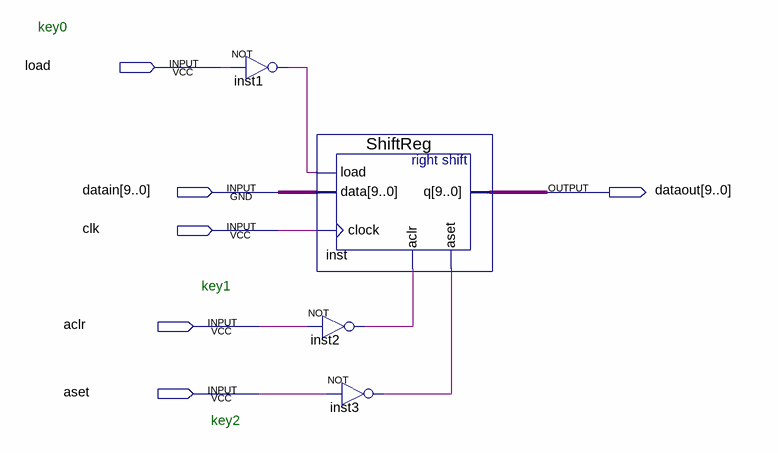
[diagram p0: schematic sheet]
// Quartus schematic cdlab5.bdf as structural Verilog: 4 symbols, 6 pins
module cdlab5 (
  input  load,
  input  [9:0] datain,
  input  clk,
  input  aclr,
  input  aset,
  output [9:0] dataout
);

  wire inst1_out, inst2_out, inst3_out;

  not inst1 (inst1_out, load);
  ShiftReg inst (.load(inst1_out), .data(datain), .clock(clk), .aclr(inst2_out), .aset(inst3_out), .q(dataout));
  not inst2 (inst2_out, aclr);
  not inst3 (inst3_out, aset);

  // Notes on the sheet:
  //   key0
  //   key1
  //   key2
endmodule
